# EAGLE schematic pcb_univ_3-8-0-x-rev2 (EAGLE 7.2.0)
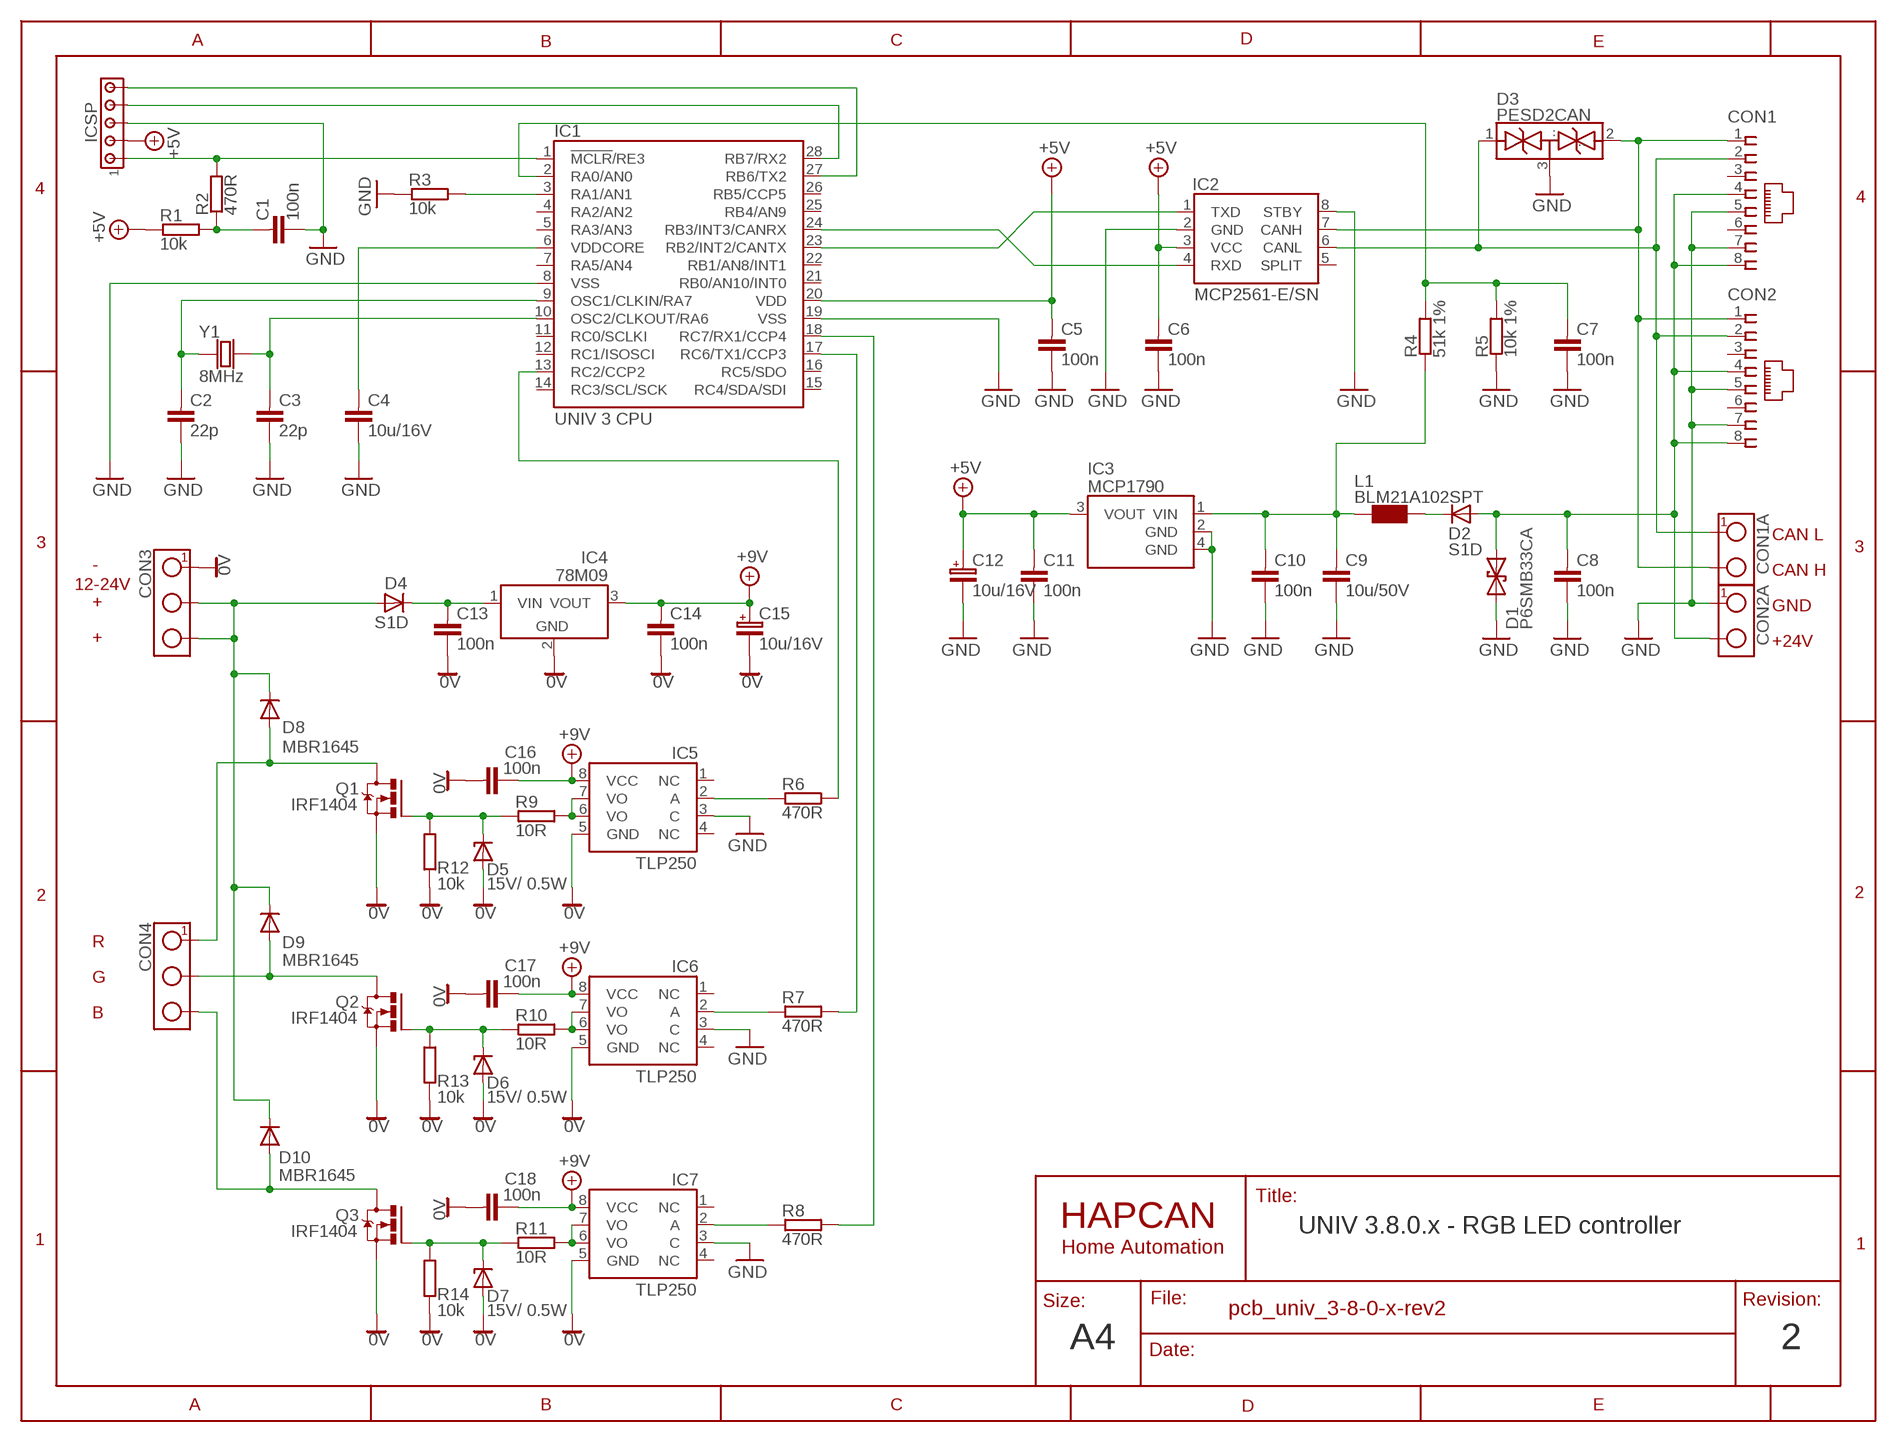
[diagram p0: schematic, sheet 1]

## Parts
C1  100n  CAPACITOR0805  [0805]
C2  22p  CAPACITOR0805  [0805]
C3  22p  CAPACITOR0805  [0805]
C4  10u/16V  CAPACITOR0805  [0805]
C5  100n  CAPACITOR0805  [0805]
C6  100n  CAPACITOR0805  [0805]
C7  100n  CAPACITOR0805  [0805]
C8  100n  CAPACITOR0805  [0805]
C9  10u/50V  CAPACITOR1210  [1210]
C10  100n  CAPACITOR0805  [0805]
C11  100n  CAPACITOR0805  [0805]
C12  10u/16V  CAPACITOR-POLARIZED-SMC_B  [SMC_B]
C13  100n  CAPACITOR0805  [0805]
C14  100n  CAPACITOR0805  [0805]
C15  10u/16V  CAPACITOR-POLARIZED-SMC_B  [SMC_B]
C16  100n  CAPACITOR0805  [0805]
C17  100n  CAPACITOR0805  [0805]
C18  100n  CAPACITOR0805  [0805]
CON1  RJ45-SOCKET  [RJ45-PCB-SOCKET]
CON1A  TERMINAL-2  TERMINAL-2-5X10,5MM  [ARK2-5X10,5MM]
CON2  RJ45-SOCKET  [RJ45-PCB-SOCKET]
CON2A  TERMINAL-2  TERMINAL-2-5X10,5MM  [ARK2-5X10,5MM]
CON3  TERMINAL-3  TERMINAL-3-5X10.5MM  [ARK3-5X10.5MM]
CON4  TERMINAL-3  TERMINAL-3-5X10.5MM  [ARK3-5X10.5MM]
D1  P6SMB33CA  DIODE_TRANSIL2  [DO-214_TRANSIL2]
D2  S1D  DIODE_DO-214  [DO-214]
D3  PESD2CAN  PESD2CANSOT-23  [SOT-23]
D4  S1D  DIODE_DO-214  [DO-214]
D5  15V/ 0.5W  DIODE_ZENER_SOD-80  [SOD-80]
D6  15V/ 0.5W  DIODE_ZENER_SOD-80  [SOD-80]
D7  15V/ 0.5W  DIODE_ZENER_SOD-80  [SOD-80]
D8  MBR1645  DIODE_TO220V  [TO220V-2]
D9  MBR1645  DIODE_TO220V  [TO220V-2]
D10  MBR1645  DIODE_TO220V  [TO220V-2]
IC1  UNIV 3 CPU  UNIV3CPU  [UNIV3CPU]
IC2  MCP2561-E/SN  [SO-08]
IC3  MCP1790  [SOT-223]
IC4  78M09  78XX-TO-252  [TO-252]
IC5  TLP250  TLP250_WIDE  [DIL-08W]
IC6  TLP250  TLP250_WIDE  [DIL-08W]
IC7  TLP250  TLP250_WIDE  [DIL-08W]
ICSP  HEADER5  [SIP-5]
L1  BLM21A102SPT  BLMXXX  [0805@1]
Q1  IRF1404  MOSFET-N  [TO220V]
Q2  IRF1404  MOSFET-N  [TO220V]
Q3  IRF1404  MOSFET-N  [TO220V]
R1  10k  RESISTOR0805  [0805]
R2  470R  RESISTOR0805  [0805]
R3  10k  RESISTOR0805  [0805]
R4  51k 1%  RESISTOR0805  [0805]
R5  10k 1%  RESISTOR0805  [0805]
R6  470R  RESISTOR0805  [0805]
R7  470R  RESISTOR0805  [0805]
R8  470R  RESISTOR0805  [0805]
R9  10R  RESISTOR0805  [0805]
R10  10R  RESISTOR0805  [0805]
R11  10R  RESISTOR0805  [0805]
R12  10k  RESISTOR0805  [0805]
R13  10k  RESISTOR0805  [0805]
R14  10k  RESISTOR0805  [0805]
Y1  8MHz  CRYSTAL-HC49V  [CRYSTAL-HC49V]

## Nets
0V: C13.2 C14.2 C15.- C16.1 C17.1 C18.1 CON3.1 D5.A D6.A D7.A IC4.2(GND) IC5.5(GND) IC6.5(GND) IC7.5(GND) Q1.3(S) Q2.3(S) Q3.3(S) R12.1 R13.1 R14.1
+5V: C5.1 C6.1 C11.1 C12.+ IC1.20(VDD) IC2.3(VCC) IC3.3(VOUT) ICSP.2 R1.1
+9V: C14.1 C15.+ C16.2 C17.2 C18.2 IC4.3(VOUT) IC5.8(VCC) IC6.8(VCC) IC7.8(VCC)
GND: C1.2 C2.2 C3.2 C4.2 C5.2 C6.2 C7.2 C8.2 C9.2 C10.2 C11.2 C12.- CON1.5 CON1.7 CON2.5 CON2.7 CON2A.1 D1.A D3.3(...) IC1.8(VSS) IC1.19(VSS) IC2.2(GND) IC2.8(STBY) IC3.2(GND) IC3.4(GND) IC5.3(C) IC6.3(C) IC7.3(C) ICSP.3 R3.1 R5.1
N$1: CON3.2 CON3.3 D4.A D8.1(C) D9.1(C) D10.1(C)
N$2: IC1.24(RB3/INT3/CANRX) IC2.4(RXD)
N$3: IC1.23(RB2/INT2/CANTX) IC2.1(TXD)
N$4: CON1.1 CON1A.2 CON2.1 D3.2(..) IC2.7(CANH)
N$5: IC5.6(VO) IC5.7(VO) R9.2
N$6: IC6.6(VO) IC6.7(VO) R10.2
N$7: C1.1 R1.2 R2.1
N$8: IC1.1(!MCLR!/RE3) ICSP.1 R2.2
N$9: C8.1 CON1.4 CON1.8 CON2.4 CON2.8 CON2A.2 D1.C D2.A
N$10: IC1.28(RB7/RX2) ICSP.4
N$11: IC6.2(A) R7.1
N$12: IC1.3(RA1/AN1) R3.2
N$13: C13.1 D4.C IC4.1(VIN)
N$14: IC1.27(RB6/TX2) ICSP.5
N$15: C3.1 IC1.10(OSC2/CLKOUT/RA6) Y1.2
N$16: C7.1 IC1.2(RA0/AN0) R4.2 R5.2
N$17: C9.1 C10.1 IC3.1(VIN) L1.1 R4.1
N$18: IC5.2(A) R6.1
N$19: IC1.13(RC2/CCP2) R6.2
N$20: IC1.17(RC6/TX1/CCP3) R7.2
N$21: IC1.18(RC7/RX1/CCP4) R8.2
N$24: CON4.2 D9.3(A) Q2.2(D)
N$26: D6.C Q2.1(G) R10.1 R13.2
N$27: CON1.2 CON1A.1 CON2.2 D3.1(.) IC2.6(CANL)
N$28: IC7.6(VO) IC7.7(VO) R11.2
N$29: IC7.2(A) R8.1
N$30: D5.C Q1.1(G) R9.1 R12.2
N$32: CON4.1 D8.3(A) Q1.2(D)
N$33: CON4.3 D10.3(A) Q3.2(D)
N$34: D7.C Q3.1(G) R11.1 R14.2
N$40: C2.1 IC1.9(OSC1/CLKIN/RA7) Y1.1
N$56: C4.1 IC1.6(VDDCORE)
N$67: D2.C L1.2
Unconnected: CON1.3 CON1.6 CON2.3 CON2.6 IC1.4(RA2/AN2) IC1.5(RA3/AN3) IC1.7(RA5/AN4) IC1.11(RC0/SCLKI) IC1.12(RC1/ISOSCI) IC1.14(RC3/SCL/SCK) IC1.15(RC4/SDA/SDI) IC1.16(RC5/SDO) IC1.21(RB0/AN10/INT0) IC1.22(RB1/AN8/INT1) IC1.25(RB4/AN9) IC1.26(RB5/CCP5) IC2.5(SPLIT) IC5.1(NC) IC5.4(NC) IC6.1(NC) IC6.4(NC) IC7.1(NC) IC7.4(NC)

## Notes on the sheet
- CAN L
- -
- CAN H
- 12-24V
- + | GND
- + | +24V
- R
- G
- B
- UNIV 3.8.0.x - RGB LED controller
- A4 | 2

## Library data of the parts
C1-C11 C13 C14 C16-C18 = HAPCAN_devices - UNIV3:CAPACITOR: HAPCAN Capacitor
C12 C15 = HAPCAN_devices - UNIV3:CAPACITOR-POLARIZED: HAPCAN Polarazied Capacitor
CON1 CON2 = HAPCAN_devices - UNIV3:RJ45-SOCKET: HAPCAN RJ45 socket
CON1A CON2A = HAPCAN_devices - UNIV3:TERMINAL-2: HAPCAN Terminal Block - 2 way
CON3 CON4 = HAPCAN_devices - UNIV3:TERMINAL-3: HAPCAN Terminal Block - 3 way
D1 = HAPCAN_devices - UNIV3-eagle5:DIODE_TRANSIL2: HAPCAN Bidirectional transil diode
D2 D4 D8-D10 = HAPCAN_devices - UNIV3:DIODE: HAPCAN Rectifier Diode
D3 = HAPCAN_devices - UNIV3:PESD2CAN: CAN bus ESD protection diode
D5-D7 = HAPCAN_devices - UNIV3:DIODE_ZENER: HAPCAN ZENER DIODE
IC1 = HAPCAN_devices - UNIV3-eagle5:UNIV3CPU: HAPCAN Microcontroller UNIV 3 CPU
IC2 = HAPCAN_devices - UNIV3:MCP2561: HAPCAN CAN Tranceiver
IC3 = HAPCAN_devices - UNIV3:MCP1790: 70 mA, High Voltage Regulator
IC4 = HAPCAN_devices - UNIV3:78XX: HAPCAN POSITIVE VOLATGE REGULATOR
IC5-IC7 = HAPCAN_devices - UNIV3:TLP250: TLP250
ICSP = HAPCAN_devices - UNIV3:HEADER5: HAPCAN Header 5
L1 = HAPCAN_devices - UNIV3:BLMXXX: Choke
Q1-Q3 = HAPCAN_devices - UNIV3:MOSFET-N: HAPCAN N-MOSFET
R1-R14 = HAPCAN_devices - UNIV3:RESISTOR: HAPCAN Resistor
Y1 = HAPCAN_devices - UNIV3:CRYSTAL: HAPCAN Crystal